# Altium project MACH DK ROLE.PrjPcb
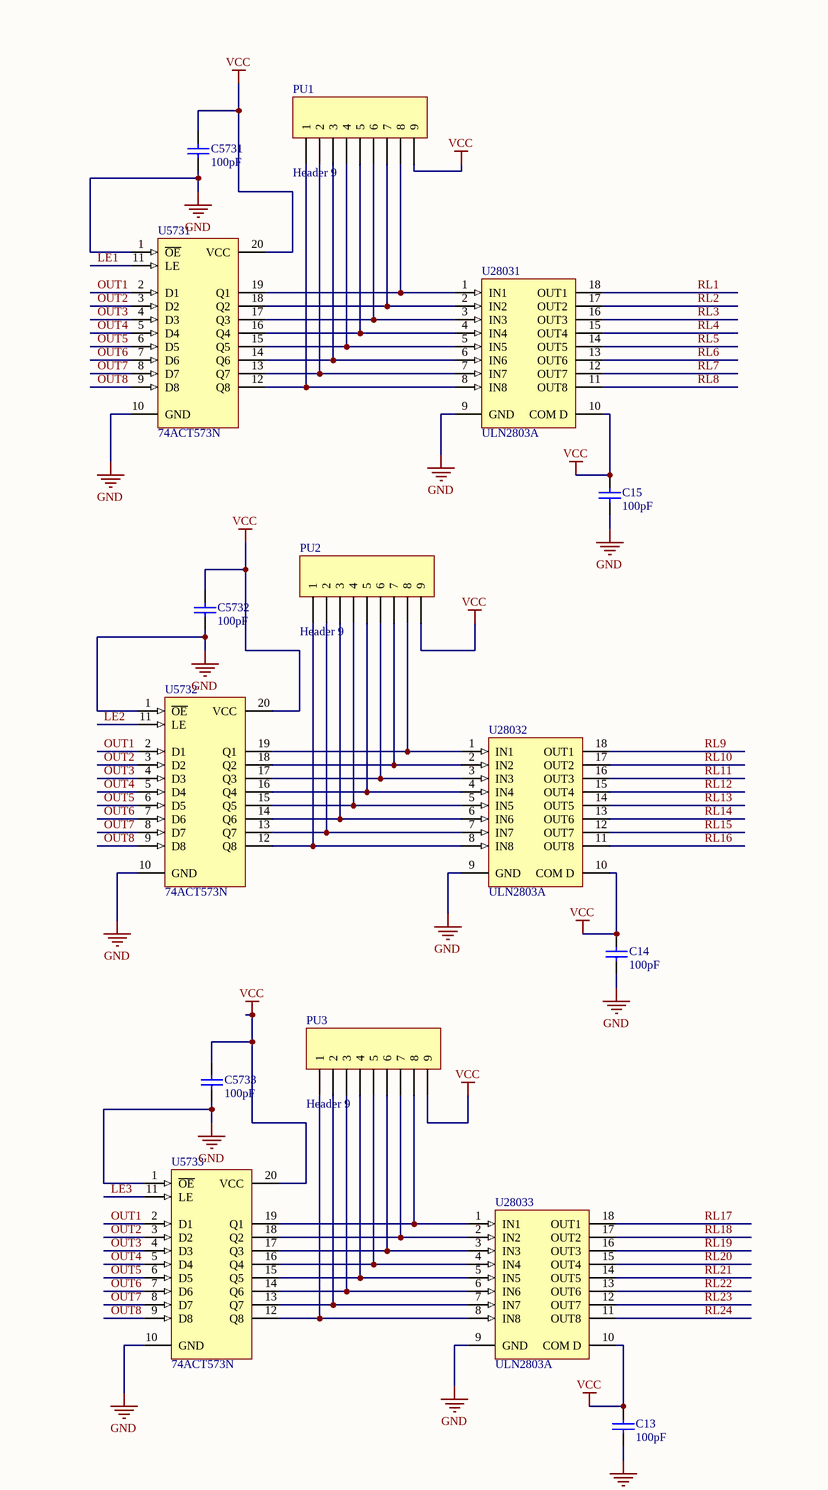
[diagram p0: mach dk role.SchDoc, top right]
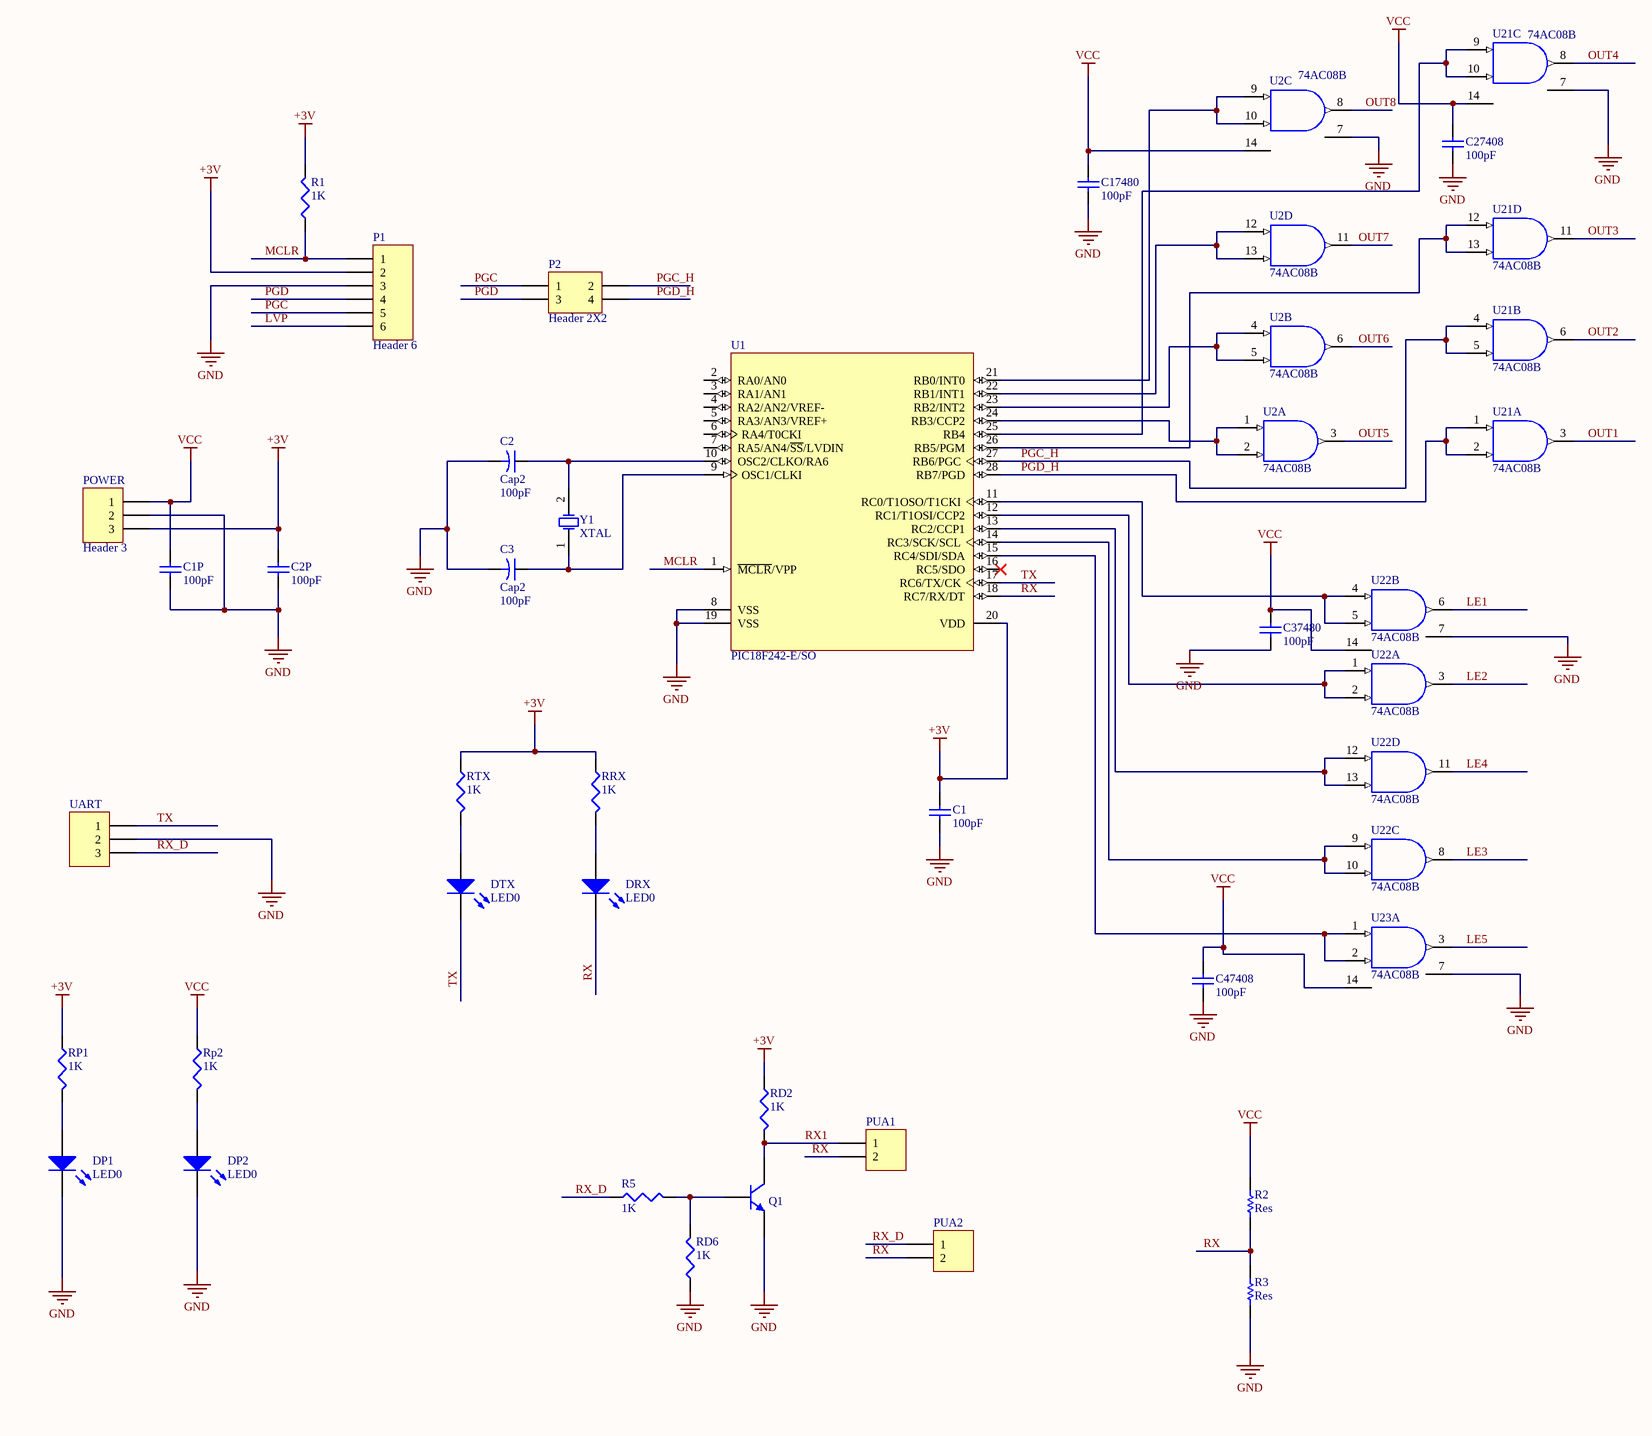
[diagram p1: mach dk role.SchDoc, bottom left]
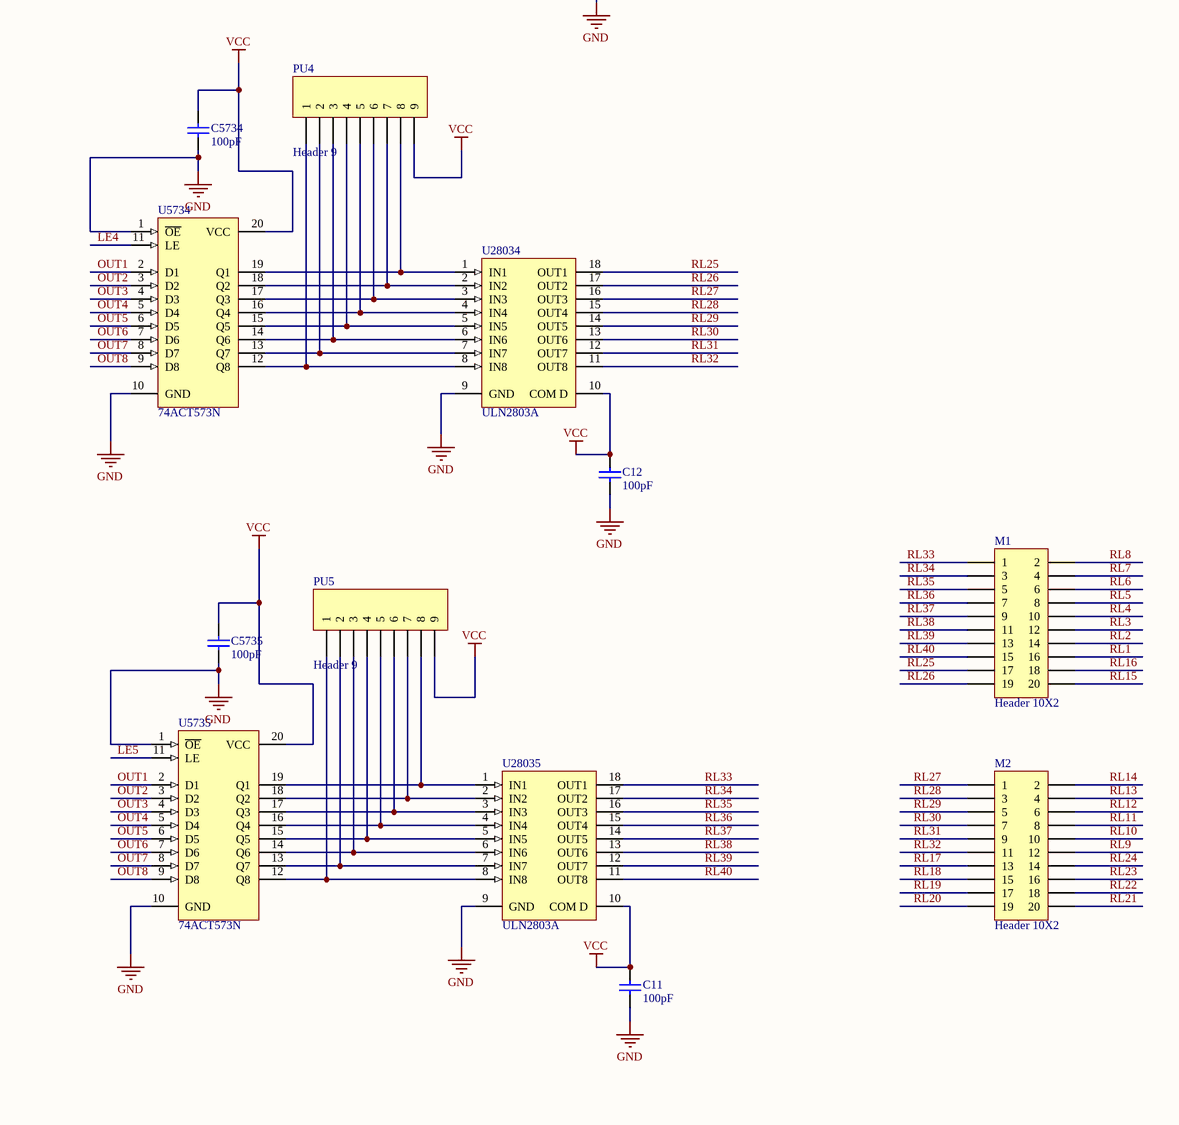
[diagram p2: mach dk role.SchDoc, bottom right]
1 sheet, 63 parts. Net scope: global (net labels, ports and power ports of the same name join across sheets).
Board file: mach dk role.PcbDoc

## Sheet mach dk role.SchDoc
size A1

### Parts
C1  value 100pF  [RAD-0.3]  (hidden comment: Cap)
C1P  value 100pF  [RAD-0.3]  (hidden comment: Cap)
C2  Cap2  value 100pF  [CAPR5-4X5]
C2P  value 100pF  [RAD-0.3]  (hidden comment: Cap)
C3  Cap2  value 100pF  [CAPR5-4X5]
C11  value 100pF  [RAD-0.3]  (hidden comment: Cap)
C12  value 100pF  [RAD-0.3]  (hidden comment: Cap)
C13  value 100pF  [RAD-0.3]  (hidden comment: Cap)
C14  value 100pF  [RAD-0.3]  (hidden comment: Cap)
C15  value 100pF  [RAD-0.3]  (hidden comment: Cap)
C5731  value 100pF  [RAD-0.3]  (hidden comment: Cap)
C5732  value 100pF  [RAD-0.3]  (hidden comment: Cap)
C5733  value 100pF  [RAD-0.3]  (hidden comment: Cap)
C5734  value 100pF  [RAD-0.3]  (hidden comment: Cap)
C5735  value 100pF  [RAD-0.3]  (hidden comment: Cap)
C17480  value 100pF  [RAD-0.3]  (hidden comment: Cap)
C27408  value 100pF  [RAD-0.3]  (hidden comment: Cap)
C37480  value 100pF  [RAD-0.3]  (hidden comment: Cap)
C47408  value 100pF  [RAD-0.3]  (hidden comment: Cap)
DP1  LED0  [LED-0]
DP2  LED0  [LED-0]
DRX  LED0  [LED-0]
DTX  LED0  [LED-0]
M1  Header 10X2  [HDR2X10]
M2  Header 10X2  [HDR2X10]
P1  Header 6  [HDR1X6]
P2  Header 2X2  [HDR2X2]
POWER  Header 3  [HDR1X3]
PU1  Header 9  [HDR1X9]
PU2  Header 9  [HDR1X9]
PU3  Header 9  [HDR1X9]
PU4  Header 9  [HDR1X9]
PU5  Header 9  [HDR1X9]
PUA1  Header 2  [HDR1X2]  (value not drawn)
PUA2  Header 2  [HDR1X2]  (value not drawn)
Q1  C1815  [C1815]  (value not drawn)
R1  value 1K  [J1-0603]  (hidden comment: Res3)
R2  Res  [R_Nor]
R3  Res  [R_Nor]
R5  value 1K  [J1-0603]  (hidden comment: Res3)
RD2  value 1K  [J1-0603]  (hidden comment: Res3)
RD6  value 1K  [J1-0603]  (hidden comment: Res3)
RP1  value 1K  [J1-0603]  (hidden comment: Res3)
Rp2  value 1K  [J1-0603]  (hidden comment: Res3)
RRX  value 1K  [J1-0603]  (hidden comment: Res3)
RTX  value 1K  [J1-0603]  (hidden comment: Res3)
U1  PIC18F242-E/SO  [SOIC300-28_N]
U2  74AC08B  [DIP14]  (parts A,B,C,D of 4)
U21  74AC08B  [DIP14]  (parts A,B,C,D of 4)
U22  74AC08B  [DIP14]  (parts A,B,C,D of 4)
U23  74AC08B  [DIP14]  (part A of 4)
U5731  74ACT573N  [N020C]
U5732  74ACT573N  [N020C]
U5733  74ACT573N  [N020C]
U5734  74ACT573N  [N020C]
U5735  74ACT573N  [N020C]
U28031  ULN2803A  [DIP18]
U28032  ULN2803A  [DIP18]
U28033  ULN2803A  [DIP18]
U28034  ULN2803A  [DIP18]
U28035  ULN2803A  [DIP18]
UART  Header 3  [HDR1X3]  (value not drawn)
Y1  XTAL  [R38]

### Nets
+3V: C1.1 C2P.1 P1.2 POWER.3 R1.2 RD2.1 RP1.1 RRX.1 RTX.1 U1.20(VDD)
GND: C1.2 C1P.2 C2.2 C2P.2 C3.2 C11.2 C12.2 C13.2 C14.2 C15.2 C5731.2 C5732.2 C5733.2 C5734.2 C5735.2 C17480.2 C27408.2 C37480.2 C47408.2 DP1.2(K) DP2.2(K) P1.3 POWER.2 Q1.1(E) R3.1 RD6.1 U1.8(VSS) U1.19(VSS) U2.7(GND) U21.7(GND) U22.7(GND) U23.7(GND) U5731.1(~{OE}) U5731.10(GND) U5732.1(~{OE}) U5732.10(GND) U5733.1(~{OE}) U5733.10(GND) U5734.1(~{OE}) U5734.10(GND) U5735.1(~{OE}) U5735.10(GND) U28031.9(GND) U28032.9(GND) U28033.9(GND) U28034.9(GND) U28035.9(GND) UART.2
VCC: C1P.1 C11.1 C12.1 C13.1 C14.1 C15.1 C5731.1 C5732.1 C5733.1 C5734.1 C5735.1 C17480.1 C27408.1 C37480.1 C47408.1 POWER.1 PU1.9 PU2.9 PU3.9 PU4.9 PU5.9 R2.2 Rp2.1 U2.14(VCC) U21.14(VCC) U22.14(VCC) U23.14(VCC) U5731.20(VCC) U5732.20(VCC) U5733.20(VCC) U5734.20(VCC) U5735.20(VCC) U28031.10(COM_D) U28032.10(COM_D) U28033.10(COM_D) U28034.10(COM_D) U28035.10(COM_D)
LE1: U22.6(Y) U5731.11(LE)
LE2: U22.3(Y) U5732.11(LE)
LE3: U22.8(Y) U5733.11(LE)
LE4: U22.11(Y) U5734.11(LE)
LE5: U23.3(Y) U5735.11(LE)
LVP: P1.6
MCLR: P1.1 R1.1 U1.1(~{MCLR}/VPP)
OUT1: U21.3(Y) U5731.2(D1) U5732.2(D1) U5733.2(D1) U5734.2(D1) U5735.2(D1)
OUT2: U21.6(Y) U5731.3(D2) U5732.3(D2) U5733.3(D2) U5734.3(D2) U5735.3(D2)
OUT3: U21.11(Y) U5731.4(D3) U5732.4(D3) U5733.4(D3) U5734.4(D3) U5735.4(D3)
OUT4: U21.8(Y) U5731.5(D4) U5732.5(D4) U5733.5(D4) U5734.5(D4) U5735.5(D4)
OUT5: U2.3(Y) U5731.6(D5) U5732.6(D5) U5733.6(D5) U5734.6(D5) U5735.6(D5)
OUT6: U2.6(Y) U5731.7(D6) U5732.7(D6) U5733.7(D6) U5734.7(D6) U5735.7(D6)
OUT7: U2.11(Y) U5731.8(D7) U5732.8(D7) U5733.8(D7) U5734.8(D7) U5735.8(D7)
OUT8: U2.8(Y) U5731.9(D8) U5732.9(D8) U5733.9(D8) U5734.9(D8) U5735.9(D8)
PGC: P1.5 P2.1
PGC_H: P2.2 U1.27(RB6/PGC) U21.4(A) U21.5(B)
PGD: P1.4 P2.3
PGD_H: P2.4 U1.28(RB7/PGD) U21.1(A) U21.2(B)
RL1: M1.16 U28031.18(OUT1)
RL2: M1.14 U28031.17(OUT2)
RL3: M1.12 U28031.16(OUT3)
RL4: M1.10 U28031.15(OUT4)
RL5: M1.8 U28031.14(OUT5)
RL6: M1.6 U28031.13(OUT6)
RL7: M1.4 U28031.12(OUT7)
RL8: M1.2 U28031.11(OUT8)
RL9: M2.12 U28032.18(OUT1)
RL10: M2.10 U28032.17(OUT2)
RL11: M2.8 U28032.16(OUT3)
RL12: M2.6 U28032.15(OUT4)
RL13: M2.4 U28032.14(OUT5)
RL14: M2.2 U28032.13(OUT6)
RL15: M1.20 U28032.12(OUT7)
RL16: M1.18 U28032.11(OUT8)
RL17: M2.13 U28033.18(OUT1)
RL18: M2.15 U28033.17(OUT2)
RL19: M2.17 U28033.16(OUT3)
RL20: M2.19 U28033.15(OUT4)
RL21: M2.20 U28033.14(OUT5)
RL22: M2.18 U28033.13(OUT6)
RL23: M2.16 U28033.12(OUT7)
RL24: M2.14 U28033.11(OUT8)
RL25: M1.17 U28034.18(OUT1)
RL26: M1.19 U28034.17(OUT2)
RL27: M2.1 U28034.16(OUT3)
RL28: M2.3 U28034.15(OUT4)
RL29: M2.5 U28034.14(OUT5)
RL30: M2.7 U28034.13(OUT6)
RL31: M2.9 U28034.12(OUT7)
RL32: M2.11 U28034.11(OUT8)
RL33: M1.1 U28035.18(OUT1)
RL34: M1.3 U28035.17(OUT2)
RL35: M1.5 U28035.16(OUT3)
RL36: M1.7 U28035.15(OUT4)
RL37: M1.9 U28035.14(OUT5)
RL38: M1.11 U28035.13(OUT6)
RL39: M1.13 U28035.12(OUT7)
RL40: M1.15 U28035.11(OUT8)
RX: DRX.2(K) PUA1.2 PUA2.2 R2.1 R3.2 U1.18(RC7/RX/DT)
RX1: PUA1.1 Q1.2(C) RD2.2
RX_D: PUA2.1 R5.1 UART.3
TX: DTX.2(K) U1.17(RC6/TX/CK) UART.1
NetC2_1: C2.1 U1.10(OSC2/CLKO/RA6) Y1.2(OSC2)
NetC3_1: C3.1 U1.9(OSC1/CLKI) Y1.1(OSC1)
NetDP1_1: DP1.1(A) RP1.2
NetDP2_1: DP2.1(A) Rp2.2
NetDRX_1: DRX.1(A) RRX.2
NetDTX_1: DTX.1(A) RTX.2
NetPU1_1: PU1.1 U5731.12(Q8) U28031.8(IN8)
NetPU1_2: PU1.2 U5731.13(Q7) U28031.7(IN7)
NetPU1_3: PU1.3 U5731.14(Q6) U28031.6(IN6)
NetPU1_4: PU1.4 U5731.15(Q5) U28031.5(IN5)
NetPU1_5: PU1.5 U5731.16(Q4) U28031.4(IN4)
NetPU1_6: PU1.6 U5731.17(Q3) U28031.3(IN3)
NetPU1_7: PU1.7 U5731.18(Q2) U28031.2(IN2)
NetPU1_8: PU1.8 U5731.19(Q1) U28031.1(IN1)
NetPU2_1: PU2.1 U5732.12(Q8) U28032.8(IN8)
NetPU2_2: PU2.2 U5732.13(Q7) U28032.7(IN7)
NetPU2_3: PU2.3 U5732.14(Q6) U28032.6(IN6)
NetPU2_4: PU2.4 U5732.15(Q5) U28032.5(IN5)
NetPU2_5: PU2.5 U5732.16(Q4) U28032.4(IN4)
NetPU2_6: PU2.6 U5732.17(Q3) U28032.3(IN3)
NetPU2_7: PU2.7 U5732.18(Q2) U28032.2(IN2)
NetPU2_8: PU2.8 U5732.19(Q1) U28032.1(IN1)
NetPU3_1: PU3.1 U5733.12(Q8) U28033.8(IN8)
NetPU3_2: PU3.2 U5733.13(Q7) U28033.7(IN7)
NetPU3_3: PU3.3 U5733.14(Q6) U28033.6(IN6)
NetPU3_4: PU3.4 U5733.15(Q5) U28033.5(IN5)
NetPU3_5: PU3.5 U5733.16(Q4) U28033.4(IN4)
NetPU3_6: PU3.6 U5733.17(Q3) U28033.3(IN3)
NetPU3_7: PU3.7 U5733.18(Q2) U28033.2(IN2)
NetPU3_8: PU3.8 U5733.19(Q1) U28033.1(IN1)
NetPU4_1: PU4.1 U5734.12(Q8) U28034.8(IN8)
NetPU4_2: PU4.2 U5734.13(Q7) U28034.7(IN7)
NetPU4_3: PU4.3 U5734.14(Q6) U28034.6(IN6)
NetPU4_4: PU4.4 U5734.15(Q5) U28034.5(IN5)
NetPU4_5: PU4.5 U5734.16(Q4) U28034.4(IN4)
NetPU4_6: PU4.6 U5734.17(Q3) U28034.3(IN3)
NetPU4_7: PU4.7 U5734.18(Q2) U28034.2(IN2)
NetPU4_8: PU4.8 U5734.19(Q1) U28034.1(IN1)
NetPU5_1: PU5.1 U5735.12(Q8) U28035.8(IN8)
NetPU5_2: PU5.2 U5735.13(Q7) U28035.7(IN7)
NetPU5_3: PU5.3 U5735.14(Q6) U28035.6(IN6)
NetPU5_4: PU5.4 U5735.15(Q5) U28035.5(IN5)
NetPU5_5: PU5.5 U5735.16(Q4) U28035.4(IN4)
NetPU5_6: PU5.6 U5735.17(Q3) U28035.3(IN3)
NetPU5_7: PU5.7 U5735.18(Q2) U28035.2(IN2)
NetPU5_8: PU5.8 U5735.19(Q1) U28035.1(IN1)
NetQ1_3: Q1.3(B) R5.2 RD6.2
NetU1_11: U1.11(RC0/T1OSO/T1CKI) U22.4(A) U22.5(B)
NetU1_12: U1.12(RC1/T1OSI/CCP2) U22.1(A) U22.2(B)
NetU1_13: U1.13(RC2/CCP1) U22.12(A) U22.13(B)
NetU1_14: U1.14(RC3/SCK/SCL) U22.9(A) U22.10(B)
NetU1_15: U1.15(RC4/SDI/SDA) U23.1(A) U23.2(B)
NetU1_21: U1.21(RB0/INT0) U2.9(A) U2.10(B)
NetU1_22: U1.22(RB1/INT1) U2.12(A) U2.13(B)
NetU1_23: U1.23(RB2/INT2) U2.4(A) U2.5(B)
NetU1_24: U1.24(RB3/CCP2) U2.1(A) U2.2(B)
NetU1_25: U1.25(RB4) U21.9(A) U21.10(B)
NetU1_26: U1.26(RB5/PGM) U21.12(A) U21.13(B)

Not connected (* = marked no-connect by the designer): U1 2(RA0/AN0) 3(RA1/AN1) 4(RA2/AN2/VREF-) 5(RA3/AN3/VREF+) 6(RA4/T0CKI) 7(RA5/AN4/~{SS}/LVDIN) 16(RC5/SDO)*

### Library data of the parts
C1 C1P C2P C11-C15 C5731-C5735 C17480 C27408 C37480 C47408 = Cap: Capacitor; Published: 8-Jun-2000; LatestRevisionDate: 17-Jul-2002; LatestRevisionNote: Re-released for DXP Platform.; PackageReference: RAD-0.3; Publisher: Altium Limited
C2 C3 = Cap2: Capacitor; Published: 23-Sep-2002; PackageReference: CAPR5-4X5; Publisher: Altium Limited
DP1 DP2 DRX DTX = LED0: Typical INFRARED GaAs LED; Published: 8-Jun-2000; LatestRevisionDate: 08-Jul-2005; LatestRevisionNote: Mech Layer 1 removed.; PackageReference: LED-0; Publisher: Altium Limited
M1 M2 = Header 10X2: Header, 10-Pin, Dual row; LatestRevisionDate: 17-Jul-2002; LatestRevisionNote: Re-released for DXP Platform.; Publisher: Altium Limited
P1 = Header 6: Header, 6-Pin; LatestRevisionDate: 17-Jul-2002; LatestRevisionNote: Re-released for DXP Platform.; Publisher: Altium Limited
P2 = Header 2X2: Header, 2-Pin, Dual row; LatestRevisionDate: 17-Jul-2002; LatestRevisionNote: Re-released for DXP Platform.; Publisher: Altium Limited
POWER UART = Header 3: Header, 3-Pin; LatestRevisionDate: 17-Jul-2002; LatestRevisionNote: Re-released for DXP Platform.; Publisher: Altium Limited
PU1-PU5 = Header 9: Header, 9-Pin; LatestRevisionDate: 17-Jul-2002; LatestRevisionNote: Re-released for DXP Platform.; Publisher: Altium Limited
PUA1 PUA2 = Header 2: Header, 2-Pin; LatestRevisionDate: 17-Jul-2002; LatestRevisionNote: Re-released for DXP Platform.; Publisher: Altium Limited
R1 R5 RD2 RD6 RP1 Rp2 RRX RTX = Res3: Resistor; Published: 8-Jun-2000; LatestRevisionDate: 04-Mar-2005; LatestRevisionNote: PCB Footprint replaced.; PackageReference: J1-0603; Publisher: Altium Limited
U1 = PIC18F242-E/SO: High Performance, Enhanced FLASH Microcontroller with 10-Bit A/D, 16K FLASH, 28-Pin SOIC, Standard Volt Range, Extended Temperature; Note: RB3 is the alternate pin for the CCP2 pin multiplexing.; Published: 11-Oct-2004; LatestRevisionDate: 13-Apr-2006; LatestRevisionNote: IPC-7351 Footprint Added.; DatasheetVersion: DS39564B_2002; PackageVersion: 2005; PackageReference: SOIC300-28; Publisher: Altium Limited; PackageDescription: 28-Pin Small Outline Integrated Circuit 1.27 mm Pitch; Code_JEDEC: MS-013; ComponentLink1Description: Manufacturer Link; ComponentLink1URL: http://www.microchip.com; ComponentLink2Description: Datasheet; ComponentLink2URL: http://ww1.microchip.com/downloads/en/DeviceDoc/39564b.pdf; ComponentLink3Description: Packaging Specification; ComponentLink3URL: http://ww1.microchip.com/downloads/en/PackagingSpec/00049AD.pdf
U2 U21-U23 = 74AC08B: Quad 2-Input AND Gate; Published: 8-Jun-2000; LatestRevisionDate: 06-Jun-2005; LatestRevisionNote: Stylized 3D Model Added.; DatasheetVersion: Apr-1997; PackageVersion: Jan-1997; PackageReference: DIP14; Publisher: Altium Limited; PackageDescription: DIP; 14 Leads; Row Spacing 7.62 mm; Pitch 2.54 mm; ComponentLink1Description: Manufacturer Link; ComponentLink1URL: http://www.st.com/; ComponentLink2Description: Datasheet; ComponentLink2URL: http://www.st.com/stonline/products/literature/ds/4694/74ac08.pdf
U5731-U5735 = 74ACT573N: Octal D-Type Transparent Latch with 3-State Outputs; Published: 8-Jun-2000; LatestRevisionDate: 04-Mar-2005; LatestRevisionNote: Stylized 3D Model Added.; DatasheetVersion: Oct-1995; PackageVersion: Oct-1995; PackageReference: N020C; Publisher: Altium Limited; PackageDescription: DIP; 20 Leads; Row Spacing 7.62 mm; Pitch 2.54 mm; ComponentLink1Description: Manufacturer Link; ComponentLink1URL: http://www.ti.com/
U28031-U28035 = ULN2803A: Eight Darlington Array; Published: 8-Jun-2000; LatestRevisionDate: 06-Jun-2005; LatestRevisionNote: Stylized 3D Model Added.; DatasheetVersion: Sep-1997; PackageReference: DIP18; Publisher: Altium Limited; PackageDescription: DIP; 18 Leads; Row Spacing 7.62 mm; Pitch 2.54 mm; ComponentLink1Description: Manufacturer Link; ComponentLink1URL: http://www.st.com/; ComponentLink2Description: Datasheet; ComponentLink2URL: http://www.st.com/stonline/products/literature/ds/1536/uln2801a.pdf
Y1 = XTAL: Crystal Oscillator; Published: 8-Jun-2000; LatestRevisionDate: 17-Jul-2002; LatestRevisionNote: Re-released for DXP Platform.; PackageReference: R38; Publisher: Altium Limited